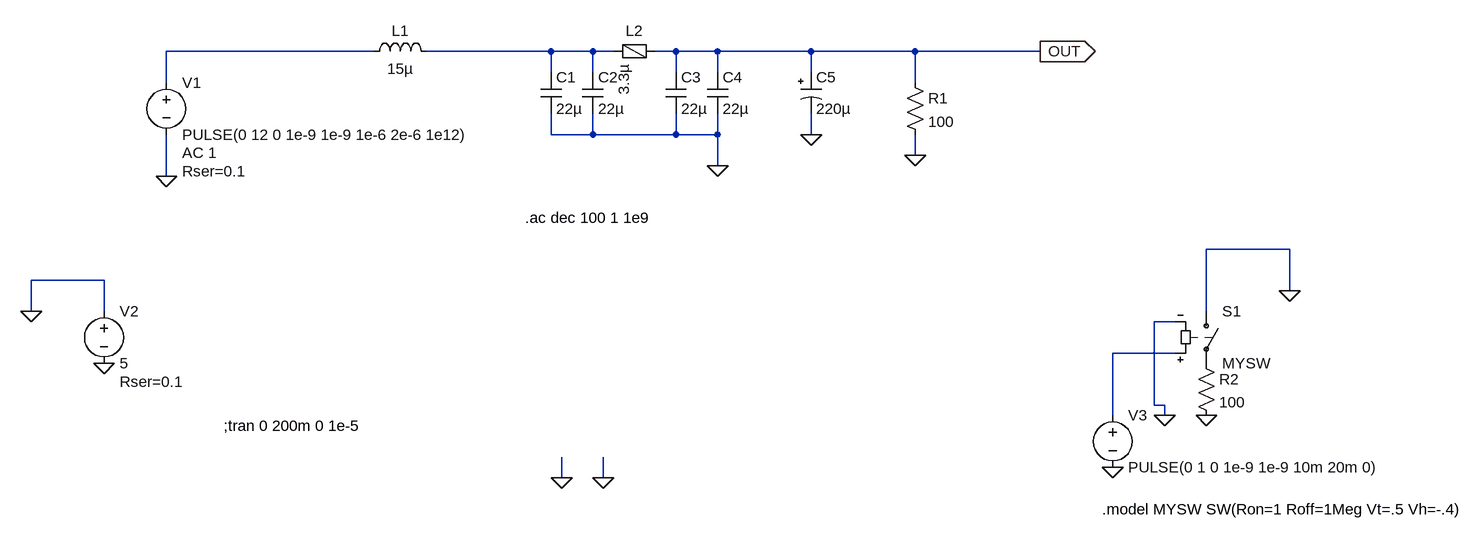
[diagram p0: schematic buck_sim.asc]
buck_sim.asc, the LTspice schematic file:
Version 4
SHEET 1 1688 832
WIRE -32 112 -352 112
WIRE 240 112 48 112
WIRE 304 112 240 112
WIRE 336 112 304 112
WIRE 432 112 400 112
WIRE 496 112 432 112
WIRE 640 112 496 112
WIRE 800 112 640 112
WIRE 992 112 800 112
WIRE 240 144 240 112
WIRE 304 144 304 112
WIRE 432 144 432 112
WIRE 496 144 496 112
WIRE 640 144 640 112
WIRE -352 160 -352 112
WIRE 800 160 800 112
WIRE 240 240 240 208
WIRE 304 240 304 208
WIRE 304 240 240 240
WIRE 432 240 432 208
WIRE 432 240 304 240
WIRE 496 240 496 208
WIRE 496 240 432 240
WIRE 640 240 640 208
WIRE 800 272 800 240
WIRE 496 288 496 240
WIRE -352 304 -352 240
WIRE 1376 416 1248 416
WIRE -448 464 -560 464
WIRE 1376 480 1376 416
WIRE -560 512 -560 464
WIRE -448 512 -448 464
WIRE 1248 512 1248 416
WIRE 1200 528 1168 528
WIRE 1200 576 1104 576
WIRE 1168 656 1168 528
WIRE 1184 656 1168 656
WIRE 1104 672 1104 576
WIRE 1184 672 1184 656
WIRE 256 768 256 736
WIRE 320 768 320 736
FLAG 496 288 0
FLAG -352 304 0
FLAG 992 112 OUT
IOPIN 992 112 Out
FLAG 800 272 0
FLAG 1248 672 0
FLAG 1184 672 0
FLAG 1104 752 0
FLAG 256 768 0
FLAG 320 768 0
FLAG 640 240 0
FLAG 1376 480 0
FLAG -448 592 0
FLAG -560 512 0
SYMBOL ind -48 128 R270
WINDOW 0 32 56 VTop 2
WINDOW 3 5 56 VBottom 2
SYMATTR InstName L1
SYMATTR Value 15µ
SYMATTR SpiceLine Ipk=0.2 Rser=2.5 Rpar=39780.5 Cpar=2.671p mfg="Würth Elektronik" pn="744766115 WE-GF 1812"
SYMBOL cap 224 144 R0
SYMATTR InstName C1
SYMATTR Value 22µ
SYMATTR SpiceLine V=10 Irms=0 Rser=0.0039 Lser=1.129n mfg="Würth Elektronik" pn="885012209006 WCAP-CSGP 1210" type="X7R"
SYMBOL cap 288 144 R0
SYMATTR InstName C2
SYMATTR Value 22µ
SYMATTR SpiceLine V=10 Irms=0 Rser=0.0039 Lser=1.129n mfg="Würth Elektronik" pn="885012209006 WCAP-CSGP 1210" type="X7R"
SYMBOL cap 416 144 R0
SYMATTR InstName C3
SYMATTR Value 22µ
SYMATTR SpiceLine V=10 Irms=0 Rser=0.0039 Lser=1.129n mfg="Würth Elektronik" pn="885012209006 WCAP-CSGP 1210" type="X7R"
SYMBOL cap 480 144 R0
SYMATTR InstName C4
SYMATTR Value 22µ
SYMATTR SpiceLine V=10 Irms=0 Rser=0.0039 Lser=1.129n mfg="Würth Elektronik" pn="885012209006 WCAP-CSGP 1210" type="X7R"
SYMBOL voltage -352 144 R0
WINDOW 123 24 124 Left 2
WINDOW 39 24 152 Left 2
SYMATTR Value2 AC 1
SYMATTR SpiceLine Rser=0.1
SYMATTR InstName V1
SYMATTR Value PULSE(0 12 0 1e-9 1e-9 1e-6 2e-6 1e12)
SYMBOL FerriteBead 368 112 R90
WINDOW 0 -16 0 VBottom 2
SYMATTR InstName L2
SYMATTR Value 3.3µ
SYMATTR SpiceLine Ipk=0.6 Rser=0.23 Rpar=1050 Cpar=680f mfg="Würth Elektronik" pn="742792662 WE-CBF 0603"
SYMBOL res 784 144 R0
SYMATTR InstName R1
SYMATTR Value 100
SYMATTR SpiceLine tol=1 pwr=0.1
SYMBOL voltage -448 496 R0
WINDOW 123 0 0 Left 0
WINDOW 39 24 124 Left 2
SYMATTR SpiceLine Rser=0.1
SYMATTR InstName V2
SYMATTR Value 5
SYMBOL sw 1248 496 R0
SYMATTR InstName S1
SYMATTR Value MYSW
SYMBOL res 1232 576 R0
SYMATTR InstName R2
SYMATTR Value 100
SYMBOL voltage 1104 656 R0
WINDOW 123 0 0 Left 0
WINDOW 39 0 0 Left 0
SYMATTR InstName V3
SYMATTR Value PULSE(0 1 0 1e-9 1e-9 10m 20m 0)
SYMBOL polcap 624 144 R0
WINDOW 3 24 56 Left 2
SYMATTR Value 220µ
SYMATTR InstName C5
SYMATTR Description Capacitor
SYMATTR Type cap
SYMATTR SpiceLine V=16 Irms=170m Rser=0.148 Lser=3.8n mfg="Würth Elektronik" pn="865250357009 WCAP-ASNP 10x10,5" type="Al electrolytic"
TEXT -264 688 Left 2 !;tran 0 200m 0 1e-5
TEXT 200 368 Left 2 !.ac dec 100 1 1e9
TEXT 1088 816 Left 2 !.model MYSW SW(Ron=1 Roff=1Meg Vt=.5 Vh=-.4)

The netlist it stands for:
* buck_sim.asc
L1 N001 N002 15µ Ipk=0.2 Rser=2.5 Rpar=39780.5 Cpar=2.671p mfg="Würth Elektronik" pn="744766115 WE-GF 1812"
C1 N002 0 22µ V=10 Irms=0 Rser=0.0039 Lser=1.129n mfg="Würth Elektronik" pn="885012209006 WCAP-CSGP 1210" type="X7R"
C2 N002 0 22µ V=10 Irms=0 Rser=0.0039 Lser=1.129n mfg="Würth Elektronik" pn="885012209006 WCAP-CSGP 1210" type="X7R"
C3 OUT 0 22µ V=10 Irms=0 Rser=0.0039 Lser=1.129n mfg="Würth Elektronik" pn="885012209006 WCAP-CSGP 1210" type="X7R"
C4 OUT 0 22µ V=10 Irms=0 Rser=0.0039 Lser=1.129n mfg="Würth Elektronik" pn="885012209006 WCAP-CSGP 1210" type="X7R"
V1 N001 0 PULSE(0 12 0 1e-9 1e-9 1e-6 2e-6 1e12) AC 1 Rser=0.1
L2 OUT N002 3.3µ Ipk=0.6 Rser=0.23 Rpar=1050 Cpar=680f mfg="Würth Elektronik" pn="742792662 WE-CBF 0603"
R1 OUT 0 100 tol=1 pwr=0.1
V2 0 0 5 Rser=0.1
S1 0 P001 N003 0 MYSW
R2 P001 0 100
V3 N003 0 PULSE(0 1 0 1e-9 1e-9 10m 20m 0)
C5 OUT 0 220µ V=16 Irms=170m Rser=0.148 Lser=3.8n mfg="Würth Elektronik" pn="865250357009 WCAP-ASNP 10x10,5" type="Al electrolytic"
;tran 0 200m 0 1e-5
.ac dec 100 1 1e9
.model MYSW SW(Ron=1 Roff=1Meg Vt=.5 Vh=-.4)
.backanno
.end